# EAGLE schematic G850V_ESP8266_II_v6 (EAGLE 9.7.0)
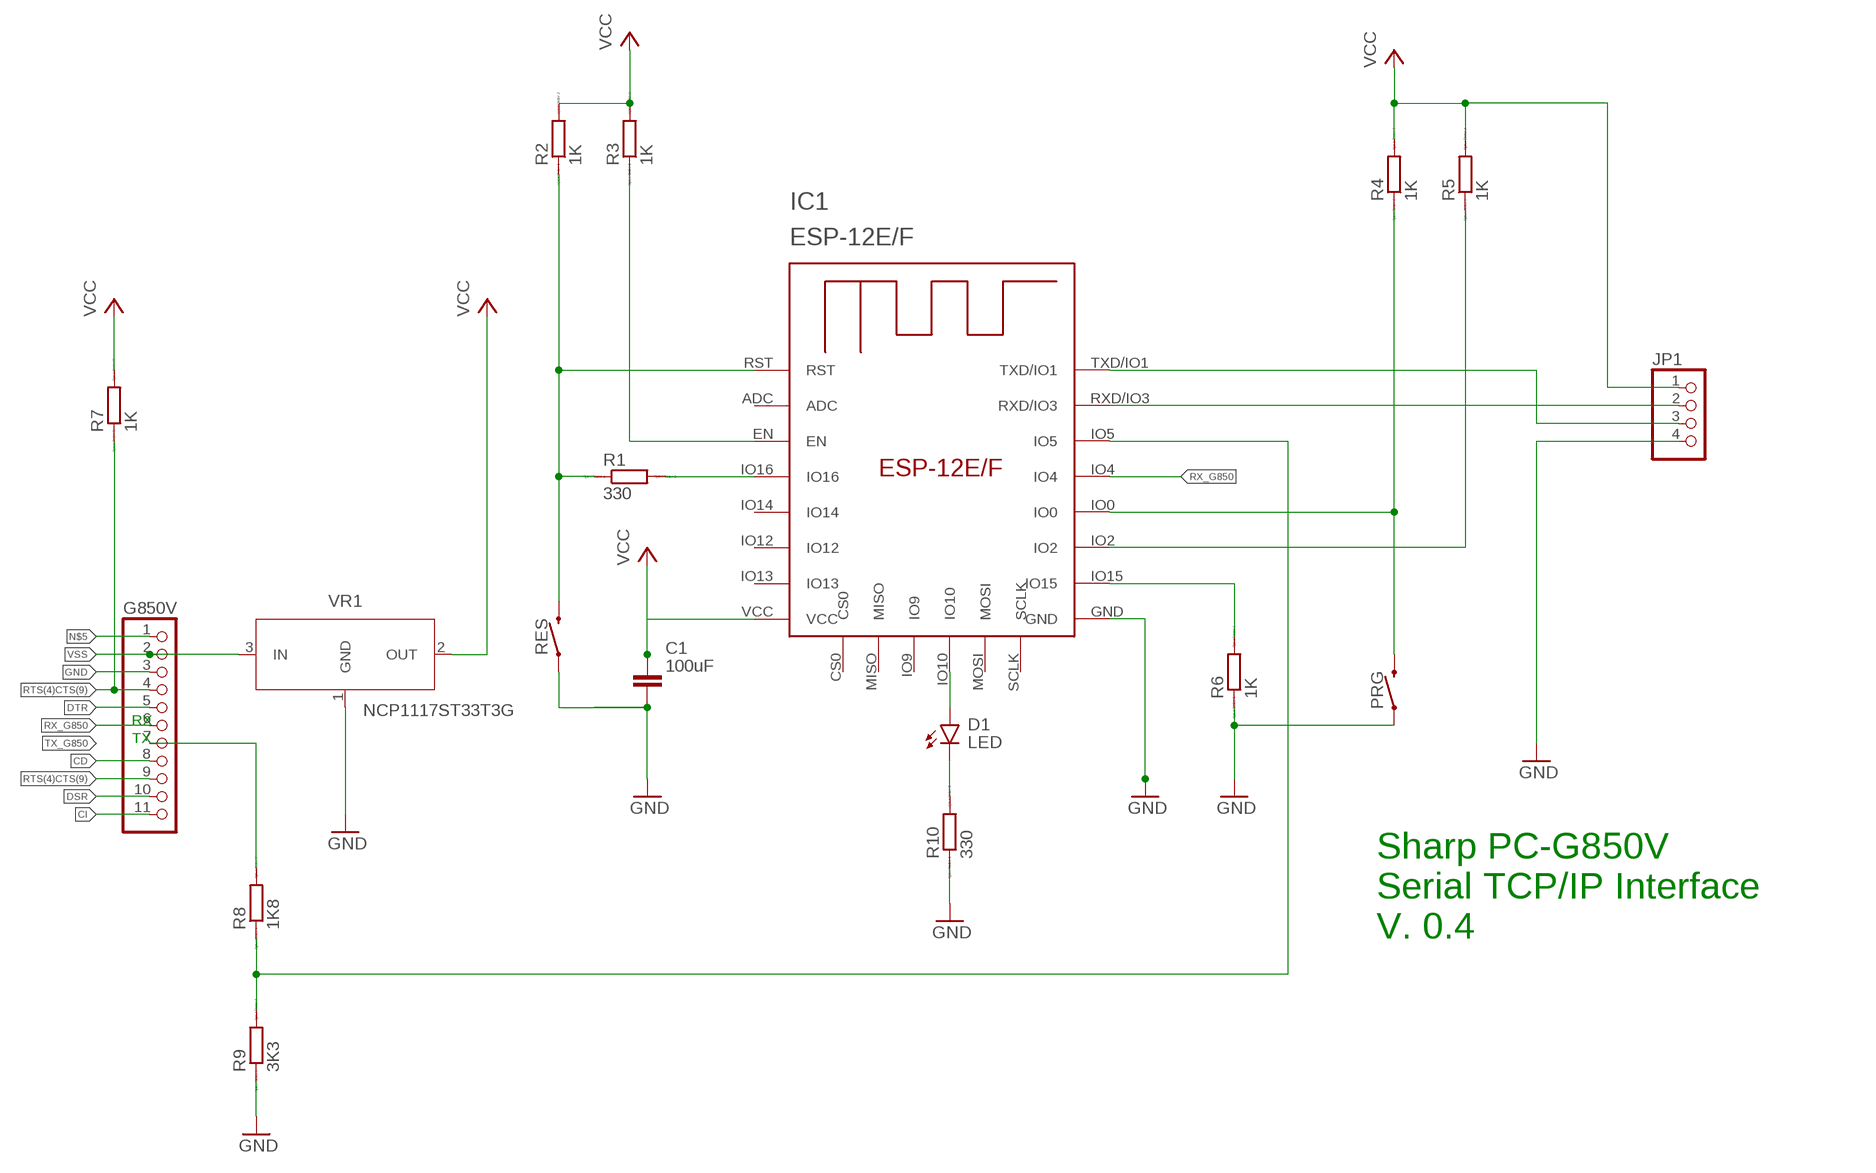
[diagram p0: schematic, sheet 1]

## Parts
C1  100uF  C_CHIP-1812(4532-METRIC)  [CAPC4532X135]
D1  LED  CHIP-FLAT-B_0805  [LEDC2012X110N_FLAT-B]
G850V  PINHD-1X11/90  [1X11/90]
IC1  ESP-12E/F  [ESP-12E]
JP1  PINHD-1X4/90  [1X04/90]
PRG  MOMENTARY-SWITCH-SPST-SMD-4.6X2.8MM  [TACTILE_SWITCH_SMD_4.6X2.8MM]
R1  330  R  [R0805]
R2  1K  R  [R0805]
R3  1K  R  [R0805]
R4  1K  R  [R0805]
R5  1K  R  [R0805]
R6  1K  R  [R0805]
R7  1K  R  [R0805]
R8  1K8  R  [R0805]
R9  3K3  R  [R0805]
R10  330  R  [R0805]
RES  MOMENTARY-SWITCH-SPST-SMD-4.6X2.8MM  [TACTILE_SWITCH_SMD_4.6X2.8MM]
VR1  NCP1117ST33T3G  NCP1117ST33T3GSOT-223  [SOT230P700X170-4]

## Nets
CD: G850V.8
CI: G850V.11
DSR: G850V.10
DTR: G850V.5
GND: C1.2 G850V.3 IC1.GND JP1.4 PRG.1 PRG.2 R6.1 R9.1 R10.1 RES.1 RES.2 VR1.1(GND)
N$1: IC1.RXD/IO3 JP1.2
N$2: IC1.IO15 R6.2
N$3: IC1.IO0 PRG.3 PRG.4 R4.1
N$4: IC1.TXD/IO1 JP1.3
N$5: G850V.1
N$6: IC1.IO2 R5.1
N$7: IC1.IO16 R1.2
N$8: IC1.RST R1.1 R2.1 RES.3 RES.4
N$9: IC1.IO5 R8.1 R9.2
N$10: IC1.EN R3.1
N$11: D1.A IC1.IO10
N$12: D1.C R10.2
RTS(4)CTS(9): G850V.4 G850V.9 R7.1
RX_G850: G850V.6 IC1.IO4
TX_G850: G850V.7 R8.2
VCC: C1.1 IC1.VCC JP1.1 R2.2 R3.2 R4.2 R5.2 R7.2 VR1.2(OUT)
VSS: G850V.2 VR1.3(IN)
Unconnected: IC1.ADC IC1.CS0 IC1.IO9 IC1.IO12 IC1.IO13 IC1.IO14 IC1.MISO IC1.MOSI IC1.SCLK

## Notes on the sheet
- RX
- TX
- Sharp PC-G850V
  Serial TCP/IP Interface
  V. 0.4

## Library data of the parts
C1 = Capacitor:C: Capacitor - Generic; CATEGORY: Capacitor
D1 = LED:CHIP-FLAT-B; CATEGORY: LED; COLOR: BLUE; DESCRIPTION: CHIP LED FLAT; SUB-CATEGORY: CHIP; TYPE: FLAT_TOP; VALUE: LED_BLUE
G850V = Connector:PINHD-1X11: PIN HEADER; CATEGORY: CONNECTOR; SUB-CATEGORY: PIN-HEADER
IC1 = esp-12e-f:ESP-12E/F
JP1 = Connector:PINHD-1X4: PIN HEADER; CATEGORY: CONNECTOR; SUB-CATEGORY: PIN-HEADER
PRG RES = SparkFun-Switches:MOMENTARY-SWITCH-SPST: Momentary Switch (Pushbutton) - SPST Normally-open (NO) SPST momentary switches (buttons, pushbuttons). Variants PTH-12MM - 12mm square, through-hole Momentary Pushbutton Switch - 12mm Square <https://www.sparkfun.com/products/9190> (COM-09190) PTH-6.0MM, PTH-6.0MM-KIT - 6.0mm square, through-hole Mini Pushbutton Switch <https://www.sparkfun.com/products/97> (COM-00097) KIT package intended for soldering kit's - only one side of pads' copper is exposed. PTH-RIGHT-ANGLE-KIT - Right-angle, through-hole Right Angle Tactile Button <https://www.sparkfun.com/products/10791> - Used on SparkFun BigTime Watch Kit <https://www.sparkfun.com/products/11734> SMD-12MM - 12mm square, surface-mount Tactile Button - SMD (12mm) <https://www.sparkfun.com/products/12993> (COM-12993) Used on SparkFun PicoBoard <https://www.sparkfun.com/products/11888> SMD-4.5MM - 4.5mm Square Trackball Switch Used on SparkFun Blackberry Trackballer Breakout <https://www.sparkfun.com/products/13169> SMD-4.6MMX2.8MM - 4.60mm x 2.80mm, surface mount Used on SparkFun SAMD21 Mini Breakout <https://www.sparkfun.com/products/13664> SMD-5.2MM, SMD-5.2-REDUNDANT - 5.2mm square, surface-mount Mini Pushbutton Switch - SMD <https://www.sparkfun.com/products/8720> (COM-08720) Used on Arduino Pro Mini <https://www.sparkfun.com/products/11114> REDUNDANT package connects both switch circuits together SMD-6.0X3.5MM - 6.0 x 3.5mm, surface mount Momentary Reset Switch SMD <https://www.sparkfun.com/products/8229> (COM-08229) SMD-6.2MM-TALL - 6.2mm square, surface mount Tactile Button - SMD (6mm) <https://www.sparkfun.com/products/12992> Used on SparkFun Digital Sandbox <https://www.sparkfun.com/products/12651> SMD-RIGHT-ANGLE - Right-angle, surface mount Used on SparkFun Block for Intel® Edison - Arduino <https://www.sparkfun.com/products/13036>; PROD_ID: SWCH-13065
R1-R10 = eagle-ltspice:R: RESISTOR, European symbol; SPICEMODEL: NONE; SPICEPREFIX: R
VR1 = IC_Power-Management:NCP1117ST33T3G: 1.0 A Low-Dropout Positive Fixed and Adjustable Voltage Regulators Datasheet <https://www.onsemi.com/pub/Collateral/NCP1117-D.PDF>; CATEGORY: IC_Power-Management; MANUFACTURER: ON Semiconductor; MPN: NCP1117ST33T3G; OPERATING_TEMP: 0 to +125 °C; PART_STATUS: Active; ROHS_COMPLIANT: RoHS3 Compliant; SERIES: NCP1117, NCV1117; SUB-CATEGORY: Voltage Regulator; TYPE: Linear

## Net classes
0 default: width 0.762 mm, drill 1.27 mm, clearance 0.457 mm